# EAGLE schematic RF (EAGLE 7.2.0)
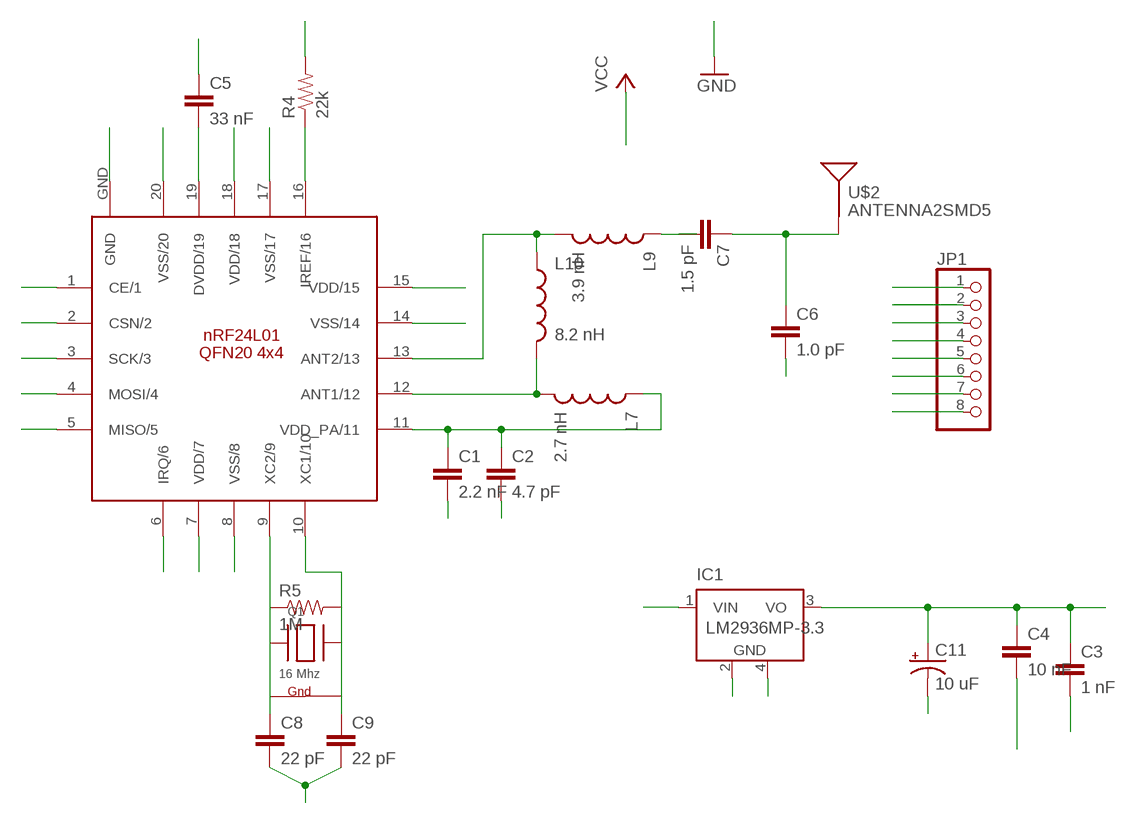
[diagram p0: schematic, sheet 1]

## Parts
C1  2.2 nF  CAP0805  [0805]
C2  4.7 pF  CAP0805  [0805]
C3  1 nF  CAP0805  [0805]
C4  10 nF  CAP0805  [0805]
C5  33 nF  CAP0805  [0805]
C6  1.0 pF  CAP0805  [0805]
C7  1.5 pF  CAP0805  [0805]
C8  22 pF  CAP0805  [0805]
C9  22 pF  CAP0805  [0805]
C11  10 uF  CAP_POL1206  [EIA3216]
IC1  LM2936MP-3.3  [SOT223]
JP1  PINHD-1X8BIG  [1X08-BIG]
L7  2.7 nH  INDUCTOR0402  [C0402]
L9  3.9 nH  INDUCTOR0402  [C0402]
L10  8.2 nH  INDUCTOR0402  [C0402]
Q1  16 Mhz  XTAL-4-3225  [NX3225]
R4  22k  RESISTOR0805-RES  [0805]
R5  1M  RESISTOR0805-RES  [0805]
U$1  NRF24L01  [QFN20(4X4)]
U$2  ANTENNA2SMD5  [ANTENNA-CHIP5]

## Nets
ANT: C6.1 C7.1 U$2.FEED(SIGNAL)
CE: JP1.2 U$1.1(CE/1)
CSN: JP1.3 U$1.2(CSN/2)
GND: C1.2 C2.2 C3.2 C4.2 C5.1 C6.2 C8.2 C9.2 C11.C(-) IC1.2(GND) IC1.4(GND) JP1.8 R4.2 U$1.8(VSS/8) U$1.14(VSS/14) U$1.17(VSS/17) U$1.20(VSS/20) U$1.GND
IQR: JP1.7 U$1.6(IRQ/6)
MISO: JP1.6 U$1.5(MISO/5)
MOSI: JP1.5 U$1.4(MOSI/4)
N$9: C8.1 Q1.1(X1) R5.1 U$1.9(XC2/9)
N$10: C9.1 Q1.3(X2) R5.2 U$1.10(XC1/10)
N$11: C1.1 C2.1 L7.1 U$1.11(VDD_PA/11)
N$12: L7.2 L10.2 U$1.12(ANT1/12)
N$13: L9.2 L10.1 U$1.13(ANT2/13)
N$15: C7.2 L9.1
N$16: R4.1 U$1.16(IREF/16)
N$19: C5.2 U$1.19(DVDD/19)
SCK: JP1.4 U$1.3(SCK/3)
VCC: IC1.1(VIN)
VDD: C3.1 C4.1 C11.A(+) IC1.3(VO) JP1.1 U$1.7(VDD/7) U$1.15(VDD/15) U$1.18(VDD/18)

## Power pins joined to a net without a drawn wire
G1: Q1.4(G1)
G2: Q1.2(G2)

## Library data of the parts
C1-C9 = SparkFun-Capacitors:CAP: Capacitor Standard 0603 ceramic capacitor, and 0.1" leaded capacitor.
C11 = SparkFun-Passives:CAP_POL: Capacitor Polarized These are standard SMD and PTH capacitors. Normally 10uF, 47uF, and 100uF in electrolytic and tantalum varieties. Always verify the external diameter of the through hole cap, it varies with capacity, voltage, and manufacturer. The EIA devices should be standard.
IC1 = national-semiconductor:LM2936MP?*: Ultra-Low Quiescent Current LDO Voltage Regulator Source: Data sheet <http://www.national.com/ds/LM/LM2936.pdf>; MF: NATIONAL SEMICONDUCTOR; MPN: LM2936MP-3.3/NOPB; OC_FARNELL: 1469062; OC_NEWARK: 41K4523
JP1 = adafruit:PINHD-1X8: PIN HEADER
L7 L9 L10 = SparkFun-Passives:INDUCTOR: Inductors Basic Inductor/Choke - 0603 and 1206. Footprints are not proven and vary greatly between part numbers. INDUCTOR POWER 3.3UH 4.0A SMD 0.197" L x 0.197" W x 0.177" H (5.00mm x 5.00mm x 4.50mm)
Q1 = adafruit:XTAL-4: Classic 4-pin 3.2 x 2.5mm crystal
R4 R5 = SparkFun-Passives:RESISTOR: Resistor Basic schematic elements and footprints for 0603, 1206, and PTH resistors.
U$1 = RF:NRF24L01
U$2 = SparkFun-RF:ANTENNA2: Chip antenna Single endded antenna. Common with smaller chip antennas. CHIP4 package is the GPS Chip Antenna SKU: GPS-08418. CHIP5 package is 2.4GHz chip antenna SKU: WRL-00144.